# Altium schematic sheet 05_SPI.SchDoc: ECE315 Analog
size A; Date: 4/25/2017; ApprovedBy: JSK; CheckedBy: JSK; Author: JSK; CompanyName: University of Wisconsin; DrawnBy: JSK; Engineer: JSK; Organization: ECE 315; Address1: College of Engineering; Address2: 1415 Engineering Drive; Address3: Madison, WI 53706; Address4: ECE 315 Fall 2017; Revision: A; SheetNumber: 2; SheetTotal: 2; AssemblyNumber: ECE315-F19; ApprovedDate: 04/02/2019
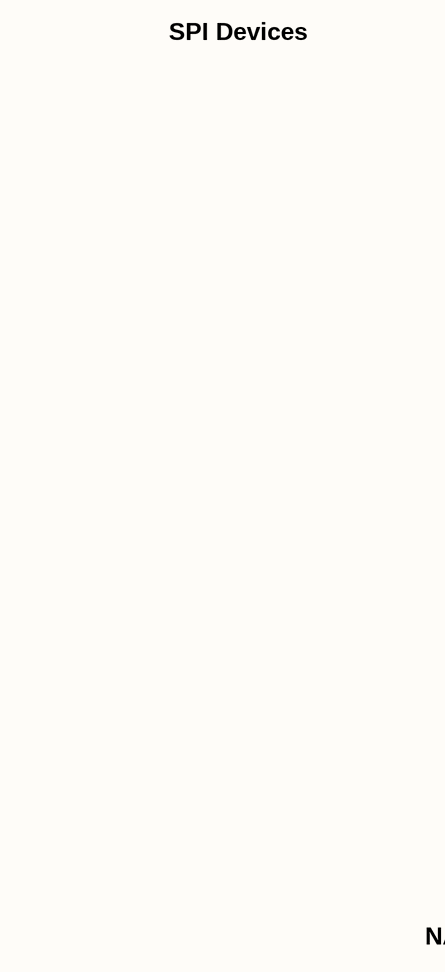
[diagram p0: 05_SPI.SchDoc]

## Notes on the sheet
- SPI Devices
- NAME: <Primary Designer>